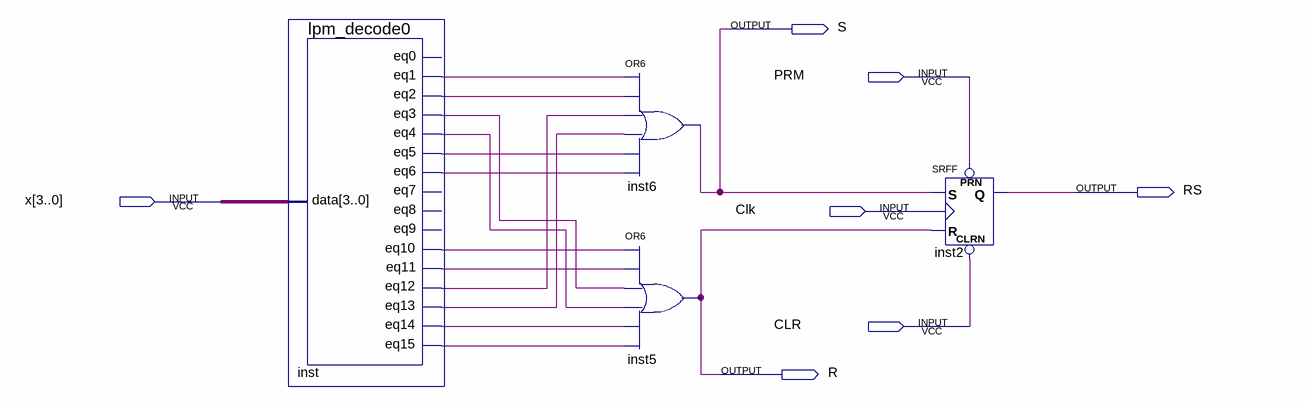
[diagram p0: schematic sheet]
// Quartus schematic RS.bdf as structural Verilog: 4 symbols, 7 pins
module RS (
  input  PRM,
  input  [3:0] x,
  input  Clk,
  input  CLR,
  output S,
  output RS,
  output R
);

  wire inst_eq1, inst_eq2, inst_eq3, inst_eq4, inst_eq5, inst_eq6, inst_eq10, inst_eq11, inst_eq12,
       inst_eq13, inst_eq14, inst_eq15;

  lpm_decode0 inst (
    .data(x), .eq1(inst_eq1), .eq2(inst_eq2), .eq3(inst_eq3), .eq4(inst_eq4), .eq5(inst_eq5), .eq6(inst_eq6),
    .eq10(inst_eq10), .eq11(inst_eq11), .eq12(inst_eq12), .eq13(inst_eq13), .eq14(inst_eq14), .eq15(inst_eq15));  // open: eq0, eq7, eq8, eq9
  or inst6 (S, inst_eq1, inst_eq2, inst_eq12, inst_eq13, inst_eq5, inst_eq6);
  or inst5 (R, inst_eq10, inst_eq11, inst_eq3, inst_eq4, inst_eq14, inst_eq15);
  SRFF inst2 (.PRN(PRM), .CLRN(CLR), .S(S), .R(R), .CLK(Clk), .Q(RS));
endmodule
